# Altium schematic sheet UBX_NORA_B1_SCHEM_0003_Shield_Conn.SchDoc
size A3; Date: 7/24/2020; CompanyName: U-blox; DrawnBy: EMOO; Engineer: EMOO; Organization: U-blox; Address1: 3950 Fairview Industrial Dr SE #100; Address2: Salem, OR 97302; SheetNumber: 3; SheetTotal: 6; SheetSize: B; SheetTitle: Connectors
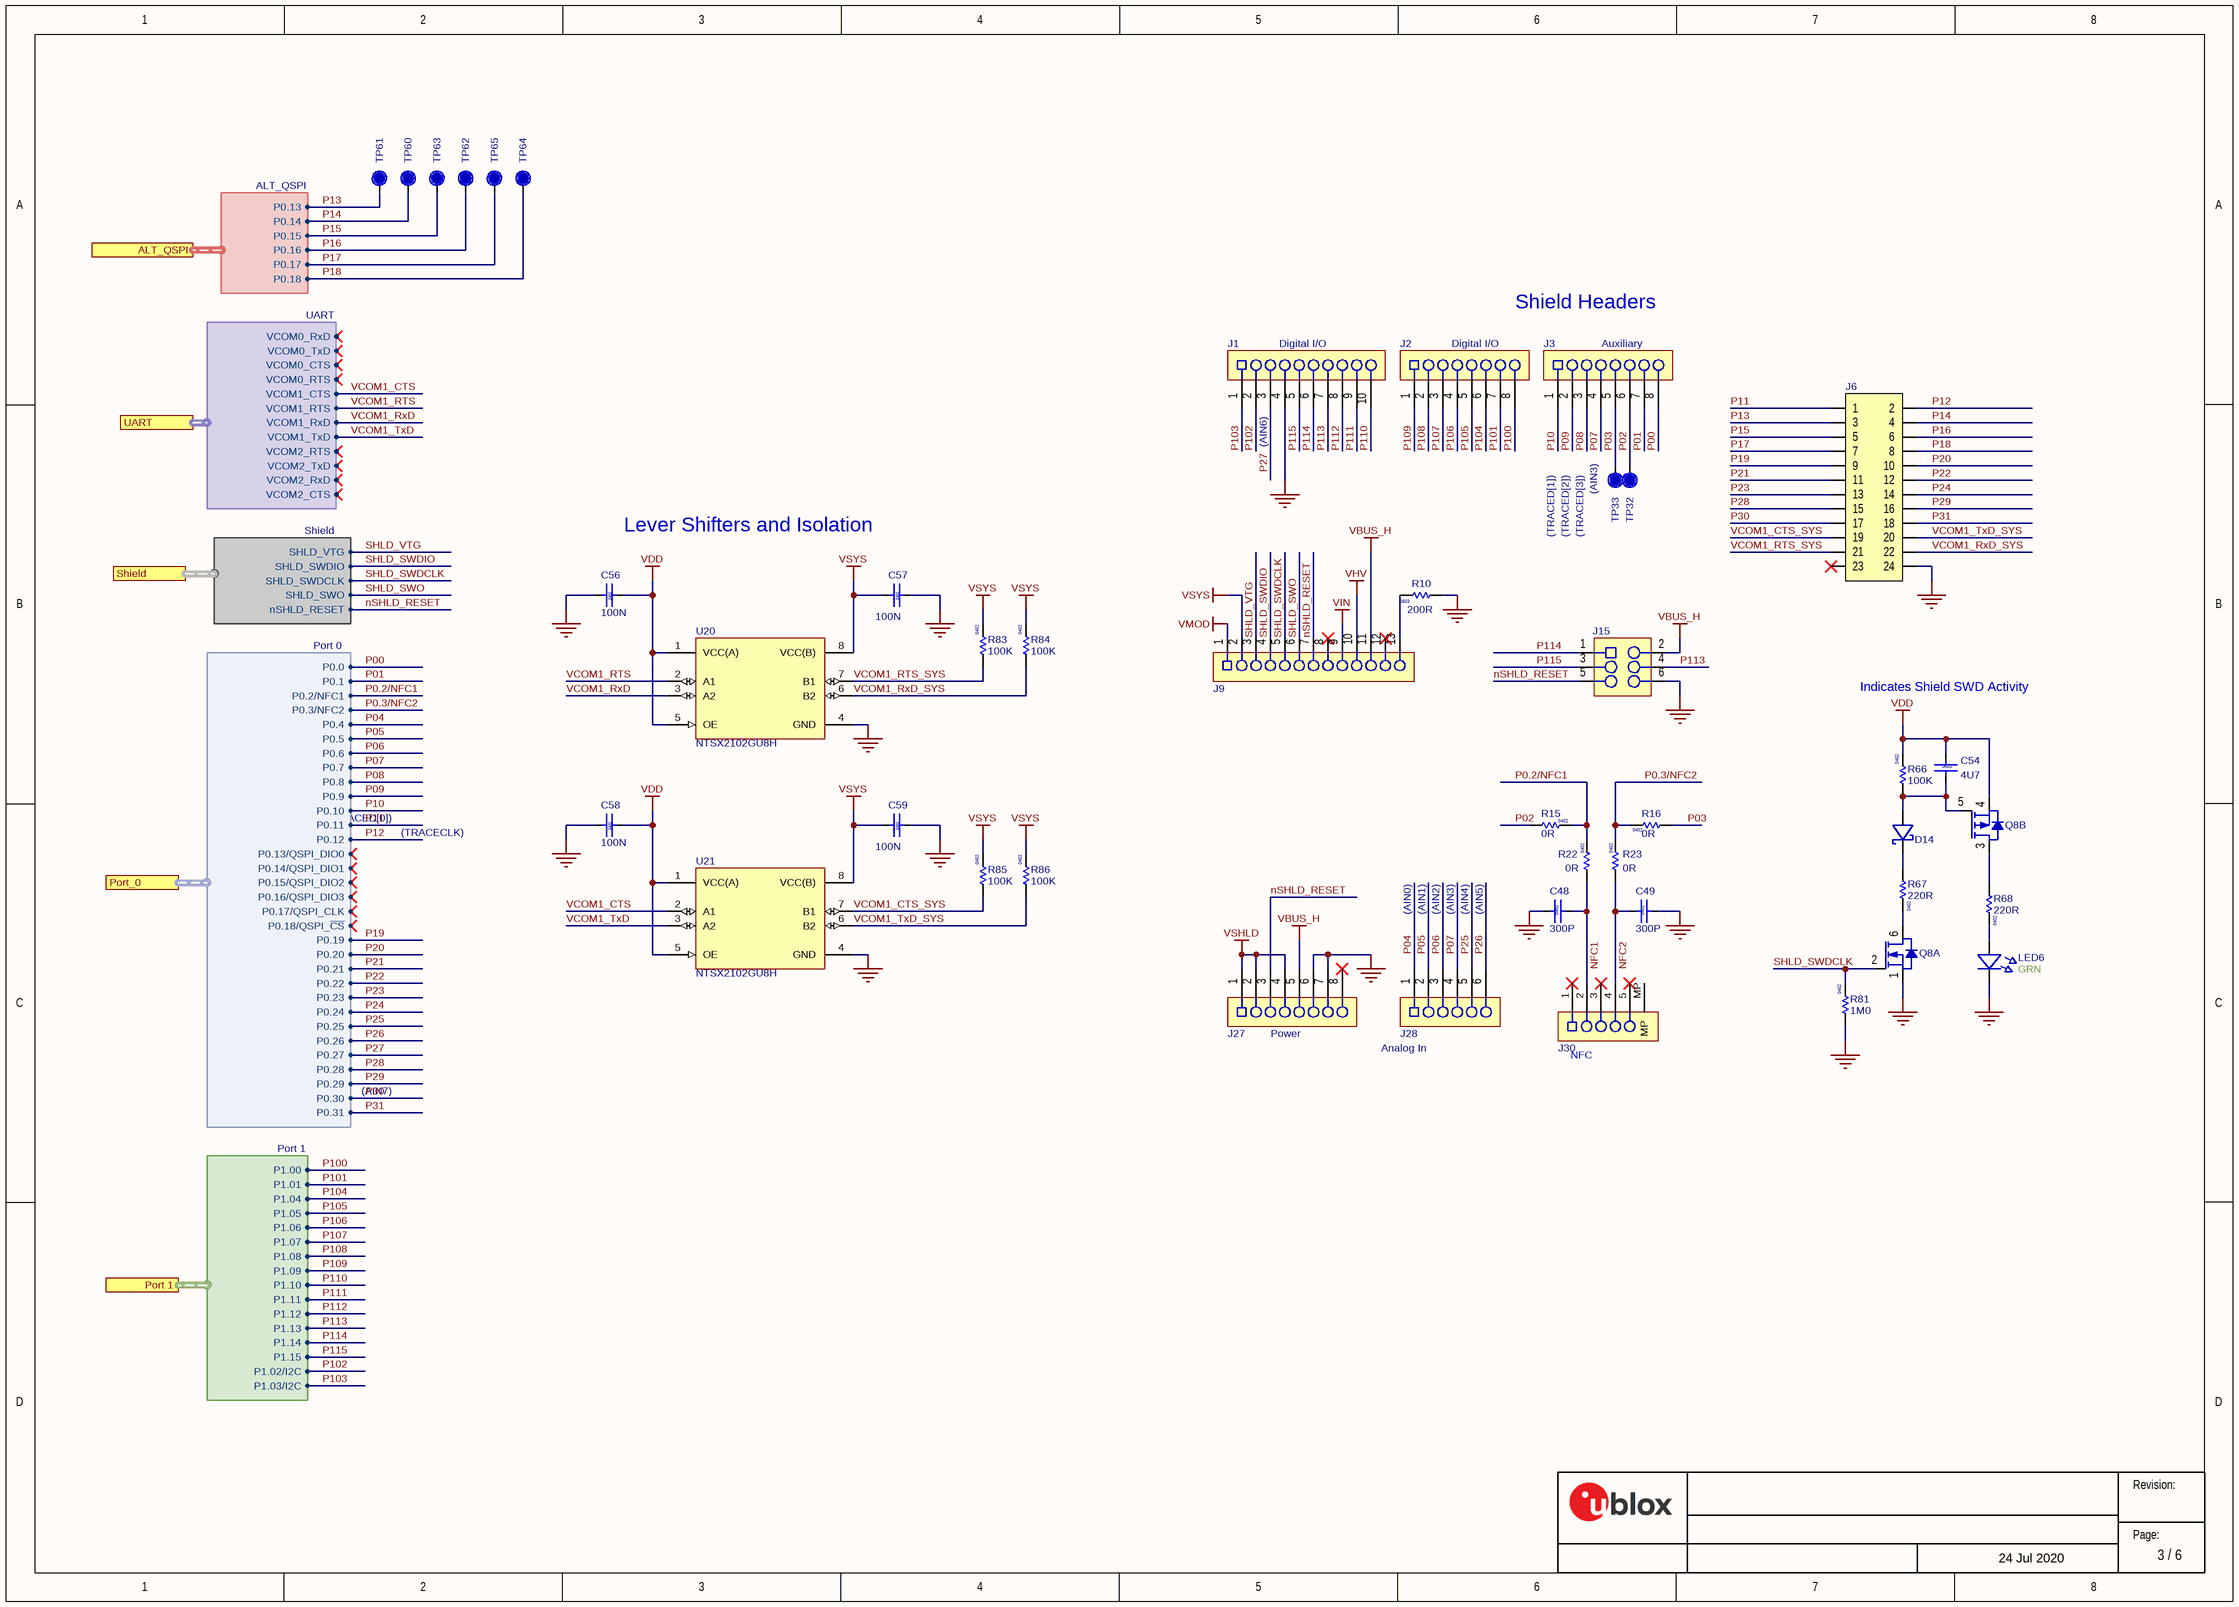
[diagram p0: UBX_NORA_B1_SCHEM_0003_Shield_Conn.SchDoc]

## Parts
C48  value 300P  Size: 0402  [Cap 0402 HD]
C49  value 300P  Size: 0402  [Cap 0402 HD]
C54  value 4U7  Size: 0603  [CAP 0603 HD]
C56  value 100N  Size: 0402  [Cap 0402 HD]
C57  value 100N  Size: 0402  [Cap 0402 HD]
C58  value 100N  Size: 0402  [Cap 0402 HD]
C59  value 100N  Size: 0402  [Cap 0402 HD]
D14  (no value)  [SOD-523]
J1  (no value)  [SKT-0.1P-SSM-110-L-SV]
J2  (no value)  [SKT-0.1P-SSM-108-L-SV]
J3  (no value)  [SKT-0.1P-SSM-108-L-SV]
J6  SSM-112-F-DV  [SSM-112-F-DV]  (value not drawn)
J9  (no value)  [TSM-113-01-L-SV]
J15  (no value)  [HDR-0.1P-6Pin-3x2-SMT]
J27  (no value)  [SKT-0.1P-SSM-108-L-SV]
J28  (no value)  [SKT-0.1P-SSM-106-L-SV]
J30  UBXH04-0000800  [Molex 051281-0594]  (value not drawn)
LED6  Color: GRN  [LED_0603_GREEN]
Q8  (no value)  [SOT-563]  (parts A,B of 2)
R10  value 200R  Size: 0603  [RES 0603 HD]
R15  value 0R  Size: 0402  [RES 0402 HD]
R16  value 0R  Size: 0402  [RES 0402 HD]
R22  value 0R  Size: 0402  [RES 0402 HD]
R23  value 0R  Size: 0402  [RES 0402 HD]
R66  value 100K  Size: 0402  [RES 0402 HD]
R67  value 220R  Size: 0402  [RES 0402 HD]
R68  value 220R  Size: 0402  [RES 0402 HD]
R81  value 1M0  Size: 0402  [RES 0402 HD]
R83  value 100K  Size: 0402  [RES 0402 HD]
R84  value 100K  Size: 0402  [RES 0402 HD]
R85  value 100K  Size: 0402  [RES 0402 HD]
R86  value 100K  Size: 0402  [RES 0402 HD]
TP32  TP  [TP10R]  (value not drawn)  (no BOM)
TP33  TP  [TP10R]  (value not drawn)  (no BOM)
TP60  TP  [TP10R]  (value not drawn)  (no BOM)
TP61  TP  [TP10R]  (value not drawn)  (no BOM)
TP62  TP  [TP10R]  (value not drawn)  (no BOM)
TP63  TP  [TP10R]  (value not drawn)  (no BOM)
TP64  TP  [TP10R]  (value not drawn)  (no BOM)
TP65  TP  [TP10R]  (value not drawn)  (no BOM)
U20  Manufacturer Part Number 1: NTSX2102GU8H  [QFN0.4P3x1-8Pin]
U21  Manufacturer Part Number 1: NTSX2102GU8H  [QFN0.4P3x1-8Pin]

## Ports
ALT_QSPI (harness ALT_QSPI), Port 1 (harness Port 1), Port_0 (harness Port 0), Shield (harness Shield), UART (harness UART)

## Harnesses
Port 1: P1.00, P1.01, P1.02/I2C, P1.03/I2C, P1.04, P1.05, P1.06, P1.07, P1.08, P1.09, P1.10, P1.11, P1.12, P1.13, P1.14, P1.15
Port 0: P0.4, P0.5, P0.6, P0.7, P0.8, P0.9, P0.10, P0.11, P0.12, P0.19, P0.20, P0.21, P0.22, P0.23, P0.24, P0.25, P0.26, P0.27, P0.28, P0.29, P0.30, P0.31, P0.3/NFC2, P0.2/NFC1, P0.13/QSPI_DIO0, P0.14/QSPI_DIO1, P0.15/QSPI_DIO2, P0.16/QSPI_DIO3, P0.18/QSPI_~{CS}, P0.17/QSPI_CLK, P0.0, P0.1
ALT_QSPI: P0.13, P0.14, P0.15, P0.16, P0.17, P0.18
Shield: SHLD_VTG, SHLD_SWDIO, SHLD_SWDCLK, SHLD_SWO, nSHLD_RESET
UART: VCOM2_TxD, VCOM2_RxD, VCOM2_RTS, VCOM2_CTS, VCOM1_RxD, VCOM1_TxD, VCOM1_CTS, VCOM1_RTS, VCOM0_RxD, VCOM0_TxD, VCOM0_CTS, VCOM0_RTS

## Nets
GND: C48.1 C49.2 C56.2 C57.1 C58.2 C59.1 J1.4 J6.24 J15.6 J27.6 J27.7 LED6.1(C) Q8.1(S1) R10.1 R81.1 U20.4(GND) U21.4(GND)
VBUS_H: J9.11 J15.2 J27.5
VDD: C54.1 C56.1 C58.1 Q8.4(S2) R66.2 U20.1(VCC(A)) U20.5(OE) U21.1(VCC(A)) U21.5(OE)
VHV: J9.10
VIN: J9.9
VMOD: J9.1
VSHLD: J27.1 J27.2 J27.4
VSYS: C57.2 C59.2 J9.2 R83.2 R84.2 R85.2 R86.2 U20.8(VCC(B)) U21.8(VCC(B))
NFC1: C48.2 J30.2 R22.1
NFC2: C49.1 J30.4 R23.1
nSHLD_RESET: J9.7 J15.5 J27.3 ; port Shield.nSHLD_RESET
P00: J3.8 ; port Port_0.P0.0
P0.2/NFC1: R15.2 R22.2 ; port Port_0.P0.2/NFC1
P0.3/NFC2: R16.2 R23.2 ; port Port_0.P0.3/NFC2
P01: J3.7 ; port Port_0.P0.1
P02: J3.6 R15.1 TP32.1
P03: J3.5 R16.1 TP33.1
P04: J28.1 ; port Port_0.P0.4
P05: J28.2 ; port Port_0.P0.5
P06: J28.3 ; port Port_0.P0.6
P07: J3.4 J28.4 ; port Port_0.P0.7
P08: J3.3 ; port Port_0.P0.8
P09: J3.2 ; port Port_0.P0.9
P10: J3.1 ; port Port_0.P0.10
P11: J6.1 ; port Port_0.P0.11
P12: J6.2 ; port Port_0.P0.12
P13: J6.3 TP61.1 ; port ALT_QSPI.P0.13
P14: J6.4 TP60.1 ; port ALT_QSPI.P0.14
P15: J6.5 TP63.1 ; port ALT_QSPI.P0.15
P16: J6.6 TP62.1 ; port ALT_QSPI.P0.16
P17: J6.7 TP65.1 ; port ALT_QSPI.P0.17
P18: J6.8 TP64.1 ; port ALT_QSPI.P0.18
P19: J6.9 ; port Port_0.P0.19
P20: J6.10 ; port Port_0.P0.20
P21: J6.11 ; port Port_0.P0.21
P22: J6.12 ; port Port_0.P0.22
P23: J6.13 ; port Port_0.P0.23
P24: J6.14 ; port Port_0.P0.24
P25: J28.5 ; port Port_0.P0.25
P26: J28.6 ; port Port_0.P0.26
P27: J1.3 ; port Port_0.P0.27
P28: J6.15 ; port Port_0.P0.28
P29: J6.16 ; port Port_0.P0.29
P30: J6.17 ; port Port_0.P0.30
P31: J6.18 ; port Port_0.P0.31
P100: J2.8 ; port Port 1.P1.00
P101: J2.7 ; port Port 1.P1.01
P102: J1.2 ; port Port 1.P1.02/I2C
P103: J1.1 ; port Port 1.P1.03/I2C
P104: J2.6 ; port Port 1.P1.04
P105: J2.5 ; port Port 1.P1.05
P106: J2.4 ; port Port 1.P1.06
P107: J2.3 ; port Port 1.P1.07
P108: J2.2 ; port Port 1.P1.08
P109: J2.1 ; port Port 1.P1.09
P110: J1.10 ; port Port 1.P1.10
P111: J1.9 ; port Port 1.P1.11
P112: J1.8 ; port Port 1.P1.12
P113: J1.7 J15.4 ; port Port 1.P1.13
P114: J1.6 J15.1 ; port Port 1.P1.14
P115: J1.5 J15.3 ; port Port 1.P1.15
SHLD_SWDCLK: J9.5 Q8.2(G1) R81.2 ; port Shield.SHLD_SWDCLK
SHLD_SWDIO: J9.4 ; port Shield.SHLD_SWDIO
SHLD_SWO: J9.6 ; port Shield.SHLD_SWO
SHLD_VTG: J9.3 ; port Shield.SHLD_VTG
VCOM1_CTS: U21.2(A1) ; port UART.VCOM1_CTS
VCOM1_CTS_SYS: J6.19 R85.1 U21.7(B1)
VCOM1_RTS: U20.2(A1) ; port UART.VCOM1_RTS
VCOM1_RTS_SYS: J6.21 R83.1 U20.7(B1)
VCOM1_RxD: U20.3(A2) ; port UART.VCOM1_RxD
VCOM1_RxD_SYS: J6.22 R84.1 U20.6(B2)
VCOM1_TxD: U21.3(A2) ; port UART.VCOM1_TxD
VCOM1_TxD_SYS: J6.20 R86.1 U21.6(B2)
NetC54_2: C54.2 D14.A(Anode) Q8.5(G2) R66.1
NetD14_C: D14.C(Cathode) R67.1
NetJ9_13: J9.13 R10.2
NetLED6_2: LED6.2(A) R68.2
NetQ8_3: Q8.3(D2) R68.1
NetQ8_6: Q8.6(D1) R67.2

Not connected (* = marked no-connect by the designer): J6 23*; J9 8* 12*; J27 8*; J30 1* 3* 5* MP

## Notes on the sheet
- (near J1) Digital I/O
- (near J2) Digital I/O
- Shield Headers
- (near J3) Auxiliary
- (near J1) (AIN6)
- Lever Shifters and Isolation
- (TRACED[1])
- (TRACED[2])
- (TRACED[3])
- (near TP33) (AIN3)
- Indicates Shield SWD Activity
- (TRACED[0])
- (TRACECLK)
- (AIN0)
- (AIN1)
- (AIN2)
- (AIN3)
- (AIN4)
- (AIN5)
- (near J27) Power
- (near J28) Analog In
- (near J30) NFC
- (AIN7)
- 24 Jul 2020
- Revision:
- Page:

## Library data of the parts
C48 C49 = UBXH01-0000594: CAP CER C0G 0402 300P 50V; Manufacturer: Murata Manufacturing Company, Ltd.; Manufacturer P/N: GRM1555C1H301JA01D; Editor: eric.moog; Env: ROHS; Permitted Use: Volume Products; Perferred: PREF; Mfg P/N Status: Active; Mfg P/N Split: 100; Mfg P/N Released: No; Part Number: UBXH01-0000594; Max Voltage: 50V; Min Operating Temp: -55°C; Max Operating Temp: 125°C; Part Type: Capacitor; UBX Wiki: https://wiki.u-blox.com/bin/view/Operations/PartDetails?index=38856; RefDes: C
C54 = UBXH01-2002003: CAP CER X5R 0603 4U7 10% 6.3V; Manufacturer: Murata Manufacturing Company, Ltd.; Manufacturer P/N: GRM188R61C475KE11; Editor: philippe.largier; Released by: roland.rust; Env: GREEN; Permitted Use: Volume Products; Perferred: PREF; Mfg P/N Status: Active; Mfg P/N Split: 100; Mfg P/N Released: Yes; Part Number: UBXH01-2002003; Tolerance: 10%; Max Voltage: 6.3V; Part Type: Capacitor; Release Data: 2016-02-02T16:39:45; UBX Wiki: https://wiki.u-blox.com/bin/view/Operations/PartDetails?index=5742; RefDes: C; Mfg P/N Datasheet: https://wiki.u-blox.com/bin/view/Generic/Docs/DocumentSummary?index=30154; Manufacturer 2: Murata Manufacturing Company, Ltd.; Manufacturer P/N 2: GRM188R61E475KE11; Mfg P/N Status 2: Active; Mfg P/N Split 2: 0; Mfg P/N Released 2: Yes; Mfg P/N Datasheet 2: https://wiki.u-blox.com/bin/view/Generic/Docs/DocumentSummary?index=30500; Manufacturer 3: Samsung Electro-Mechanics; Manufacturer P/N 3: CL10A475KO8NNN; Mfg P/N Status 3: NRND; Mfg P/N Split 3: 0; Mfg P/N Released 3: Yes; Mfg P/N Datasheet 3: https://wiki.u-blox.com/bin/view/Generic/Docs/DocumentSummary?index=28177
C56-C59 = UBXH01-2021002: CAP CER X5R 0402 100N 10% 10V; Manufacturer: Murata Manufacturing Company, Ltd.; Manufacturer P/N: GRM155R61A104KA01; Editor: roland.rust; Env: GREEN; Permitted Use: Volume Products; Perferred: PREF; Mfg P/N Status: NRND; Mfg P/N Split: 100; Mfg P/N Released: Yes; Part Number: UBXH01-2021002; Tolerance: 10%; Max Voltage: 10V; Part Type: Capacitor; Released by: roland.rust; Release Data: 2005-07-22T13:59:44; UBX Wiki: https://wiki.u-blox.com/bin/view/Operations/PartDetails?index=5759; RefDes: C; Manufacturer 2: Samsung Electro-Mechanics; Manufacturer P/N 2: CL05A104KP5NNN; Mfg P/N Status 2: Active; Mfg P/N Split 2: 0; Mfg P/N Released 2: Yes; Mfg P/N Datasheet 2: https://wiki.u-blox.com/bin/view/Generic/Docs/DocumentSummary?index=28113
D14 = UBXH07-0000039: SCHOTTKY BARRIER DIODE 30V 200mA; Manufacturer: ON Semiconductor; Value: RB521S30T1G; Editor: matej.budin; Released by: pierpaolo.arban; Env: ROHS; Permitted Use: Volume Products; Perferred: PREF; Mfg P/N Status: Active; Mfg P/N Split: 100; Mfg P/N Released: Yes; Part Number: UBXH07-0000039; Max Voltage: 30V; Max Current: 200mA; Part Type: Diode; Release Data: 2015-06-18T10:04:48; UBX Wiki: https://wiki.u-blox.com/bin/view/Operations/PartDetails?index=22753; RefDes: D; Manufacturer P/N: RB521S30T1G; Mfg P/N Datasheet: https://wiki.u-blox.com/bin/view/Generic/Docs/DocumentSummary?index=22755
J1 = UBXH04-0000788: 10 -PIN RECEPTACLE BOTTOM OR TOP ENTRY VERT 2.54MM 50V 2.5A; Manufacturer P/N: 91601-310GLF; Manufacturer: Amphenol Corporation; Value: 91601-310GLF; Editor: eric.moog; Env: ROHS; Permitted Use: Support Products; Mfg P/N Status: Active; Mfg P/N Split: 100; Mfg P/N Released: No; Part Number: UBXH04-0000788; Max Voltage: 50V; Max Current: 2.5A; Min Operating Temp: -65°C; Max Operating Temp: 150°C; Part Type: Connector; UBX Wiki: https://wiki.u-blox.com/bin/view/Operations/PartDetails?index=38561; Perferred: N/A; RefDes: J; Mfg P/N Datasheet: https://wiki.u-blox.com/bin/view/Generic/Docs/DocumentSummary?index=38560
J2 J3 J27 = UBXH04-0000789: 8 -PIN RECEPTACLE BOTTOM OR TOP ENTRY VERT 2.54MM 50V 2.5A; Manufacturer: Amphenol Corporation; Value: 91601-308GLF; Editor: eric.moog; Env: ROHS; Permitted Use: Support Products; Mfg P/N Status: Active; Mfg P/N Split: 100; Mfg P/N Released: No; Part Number: UBXH04-0000789; Max Voltage: 50V; Max Current: 2.5A; Min Operating Temp: -65°C; Max Operating Temp: 150°C; Part Type: Connector; UBX Wiki: https://wiki.u-blox.com/bin/view/Operations/PartDetails?index=38563; Perferred: N/A; RefDes: J; Manufacturer P/N: 91601-308GLF; Mfg P/N Datasheet: https://wiki.u-blox.com/bin/view/Generic/Docs/DocumentSummary?index=38560
J6 = UBXH04-0000802: 2-ROW SMD PCB CONN SOCKET 100MIL GRID 24-PIN 0.64MM SQUARE 405V 5.2A; Manufacturer 1: Samtec; Artikkelnr Noca: N.A.; Editor: eric.moog; Env: ROHS; Permitted Use: Support Products; Perferred: PREF; Mfg P/N Status: Active; Mfg P/N Split: 100; Mfg P/N Released: No; Part Number: UBXH04-0000802; Manufacturer Part Number 1: SSM-112-F-DV; ComponentLink1URL: *; ComponentLink1Description: Datasheet; ComponentLink2URL: *; ComponentLink2Description: Supplier link; HelpURL: *; Footprint Doc: SOCKET_2x12_SMD-2.54mm; LatestRevisionDate: 2019-08-05; Pin Count: 24; Value: SSM-112-F-DV; Note: *; Supplier 1: Cabcon; Supplier Part Number 1: 2171-212MS0CUNR1; Supplier 2: Samtec; Supplier Part Number 2: SSM-112-F-DV; Part number IPS: N.A.; Manufacturer: Samtec; Manufacturer P/N: SSM-112-F-DV; Max Voltage: 405V; Max Current: 5.2A; Min Operating Temp: -55°C; Max Operating Temp: 125°C; Part Type: Connector; UBX Wiki: https://wiki.u-blox.com/bin/view/Operations/PartDetails?index=38898; RefDes: J; Mfg P/N Datasheet: https://wiki.u-blox.com/bin/view/Generic/Docs/DocumentSummary?index=21260
J9 = UBXH04-0000801: 1-ROW SMD-PCB CONN 13 -PIN 2.54MM STRIP 475V 4.1A; Manufacturer: Samtec; Value: TSM-113-01-L-SV; Editor: eric.moog; Env: ROHS; Permitted Use: Support Products; Perferred: PREF; Mfg P/N Status: Active; Mfg P/N Split: 100; Mfg P/N Released: No; Part Number: UBXH04-0000801; Max Voltage: 475V; Max Current: 4.1A; Min Operating Temp: -55°C; Max Operating Temp: 125°C; Part Type: Connector; UBX Wiki: https://wiki.u-blox.com/bin/view/Operations/PartDetails?index=38895; RefDes: J; Manufacturer P/N: TSM-113-01-L-SV; Mfg P/N Datasheet: https://wiki.u-blox.com/bin/view/Generic/Docs/DocumentSummary?index=15851
J15 = UBXH04-0000805: 2-ROW CONN SMD VERT 2X06 PIN 2.54MM 100V 2A; Manufacturer P/N: 0015912060; Manufacturer: molex; Value: 0015912060; Editor: eric.moog; Env: ROHS; Permitted Use: Support Products; Perferred: PREF; Mfg P/N Status: Active; Mfg P/N Split: 100; Mfg P/N Released: No; Part Number: UBXH04-0000805; Max Voltage: 100V; Max Current: 2A; Min Operating Temp: -40°C; Max Operating Temp: 85°C; Part Type: Connector; UBX Wiki: https://wiki.u-blox.com/bin/view/Operations/PartDetails?index=38947; RefDes: J; Mfg P/N Datasheet: https://wiki.u-blox.com/bin/view/Generic/Docs/DocumentSummary?index=38946
J28 = UBXH04-0000790: 6 -PIN RECEPTACLE BOTTOM OR TOP ENTRY VERT 2.54MM 50V 2.5A; Manufacturer P/N: 91601-306GLF; Manufacturer: Amphenol Corporation; Value: 91601-306GLF; Editor: eric.moog; Env: ROHS; Permitted Use: Support Products; Mfg P/N Status: Active; Mfg P/N Split: 100; Mfg P/N Released: No; Part Number: UBXH04-0000790; Max Voltage: 50V; Max Current: 2.5A; Min Operating Temp: -65°C; Max Operating Temp: 150°C; Part Type: Connector; UBX Wiki: https://wiki.u-blox.com/bin/view/Operations/PartDetails?index=38565; Perferred: N/A; RefDes: J; Mfg P/N Datasheet: https://wiki.u-blox.com/bin/view/Generic/Docs/DocumentSummary?index=38560
J30 = UBXH04-0000800: CONN NON ZIF FPC MOLEX 51281 0.5MM PITCH 5-PIN TOP AND BOTTOM 50V 500mA; Manufacturer P/N: 0512810598; Part Name: CON FFC/FPC 0.50mm 5Pos R/A; Part_Type: Connector; Manufacturer 1: KYOCERA AVX; Manufacturer Part Number 1: 046284005001846; Item_Phase: Preliminary; Component Mounting Type: SMT; Keyed: No; Rows: 1; Use in new designs: Yes; Value: 0512810598; Editor: eric.moog; Env: ROHS; Permitted Use: Support Products; Perferred: PREF; Mfg P/N Status: Active; Mfg P/N Split: 100; Part Number: UBXH04-0000800; Color: White; Connector Type: FPC; Height: 1.3mm; Length: 4.05mm; Locking: No; Pin Pitch: 0.5mm; Pins: 5; Voltage: 50V; Width: 4.4mm; Max Voltage: 50V; Max Current: 500mA; Min Operating Temp: -30°C; Max Operating Temp: 85°C; Part Type: Connector; UBX Wiki: https://wiki.u-blox.com/bin/view/Operations/PartDetails?index=38893; RefDes: J; Manufacturer: molex; Mfg P/N Released: No; Mfg P/N Datasheet: https://wiki.u-blox.com/bin/view/Generic/Docs/DocumentSummary?index=38892
LED6 = UBXH11-0000001: LED SMD 0603 GREEN 2.5V 20mA; Manufacturer: Kingbright; Manufacturer P/N: APT1608SGC; Editor: gianni.falleroni; Released by: alex.claville; Env: ROHS; Permitted Use: Support Products; Mfg P/N Status: Active; Mfg P/N Split: 50; Mfg P/N Released: Yes; Part Number: UBXH11-0000001; Value: GREEN; Max Voltage: 2.5V; Max Current: 20mA; Size: 0603; Part Type: LED; Release Data: 2022-09-27T14:26:54; UBX Wiki: https://wiki.u-blox.com/bin/view/Operations/PartDetails?index=7902; Perferred: N/A; RefDes: DS; Mfg P/N Datasheet: https://wiki.u-blox.com/bin/view/Generic/Docs/DocumentSummary?index=37527; Manufacturer 2: Lite-on Technology Corporation; Manufacturer P/N 2: LTST-C190KGKT; Mfg P/N Status 2: Active; Mfg P/N Split 2: 50; Mfg P/N Released 2: Yes; Mfg P/N Datasheet 2: https://wiki.u-blox.com/bin/view/Generic/Docs/DocumentSummary?index=16220
Q8 = UBXH20-0000084: SMALL SIGNAL COMPLEMENTARY W/ ESD PROTECTION MOSFET SOT-563-6 PACKAGE; Manufacturer: ON Semiconductor; Value: NTZD3155CT1G; Editor: pierpaolo.arban; Released by: matej.budin; Env: ROHS; Permitted Use: Support Products; Perferred: PREF; Mfg P/N Status: Active; Mfg P/N Split: 100; Mfg P/N Released: Yes; Part Number: UBXH20-0000084; Min Operating Temp: -55°C; Max Operating Temp: 155°C; Part Type: Transistor; Release Data: 2023-01-26T11:59:16; UBX Wiki: https://wiki.u-blox.com/bin/view/Operations/PartDetails?index=37717; RefDes: Q; Manufacturer P/N: NTZD3155CT1G; Mfg P/N Datasheet: https://wiki.u-blox.com/bin/view/Generic/Docs/DocumentSummary?index=9037
R10 = UBXH18-0007056: RES THICK FILM CHIP 0603 200R 5% 100mW; Editor: andreas.thiel; Env: ROHS; Permitted Use: Volume Products; Perferred: NONPREF; Part Number: UBXH18-0007056; Tolerance: 5%; Max Power: 100mW; Part Type: Resistor; UBX Wiki: https://wiki.u-blox.com/bin/view/Operations/PartDetails?index=6682; RefDes: R
R15 R16 R22 R23 = UBXH18-0003002: RES THICK FILM CHIP 0402 0R 0 100mW; Manufacturer: KOA; Manufacturer P/N: RK73Z1ETTD; Tolerance: 0; Editor: charlotte.biber; Released by: peter.mueller; Env: ROHS; Permitted Use: Volume Products; Perferred: PREF; Mfg P/N Status: NRND; Mfg P/N Split: 100; Mfg P/N Released: Yes; Part Number: UBXH18-0003002; Max Power: 100mW; Part Type: Resistor; Release Data: 2012-06-05T09:49:55; UBX Wiki: https://wiki.u-blox.com/bin/view/Operations/PartDetails?index=6611; RefDes: R; Manufacturer 2: YAGEO; Manufacturer P/N 2: 2322_705_91001_L; Mfg P/N Status 2: NRND; Mfg P/N Split 2: 0; Mfg P/N Released 2: Yes
R66 R83-R86 = UBXH18-0000005: RES THICK FILM CHIP 0402 100K 1% 63mW; Manufacturer: KOA; Manufacturer P/N: RK73H1ETTP1003F; Editor: dario.antonaz; Released by: sandro.sestan; Env: ROHS; Permitted Use: Volume Products; Mfg P/N Status: Active; Mfg P/N Split: 100; Mfg P/N Released: Yes; Part Number: UBXH18-0000005; Tolerance: 1%; Max Power: 63mW; Part Type: Resistor; Release Data: 2009-11-30T11:05:22; UBX Wiki: https://wiki.u-blox.com/bin/view/Operations/PartDetails?index=8114; Perferred: N/A; RefDes: R; Mfg P/N Datasheet: https://wiki.u-blox.com/bin/view/Generic/Docs/DocumentSummary?index=8222; Manufacturer 2: ROHM; Manufacturer P/N 2: MCR01MZPF1003; Mfg P/N Status 2: Active; Mfg P/N Split 2: 0; Mfg P/N Released 2: Yes; Mfg P/N Datasheet 2: https://wiki.u-blox.com/bin/view/Generic/Docs/DocumentSummary?index=8186
R67 R68 = UBXH18-0008033: RES THICK FILM CHIP 0402 220R 5% 100mW; Manufacturer: ROHM; Manufacturer P/N: MCR01MZPJ221; Editor: roland.rust; Env: ROHS; Permitted Use: Volume Products; Perferred: PREF; Mfg P/N Status: Active; Mfg P/N Split: 100; Mfg P/N Released: Yes; Part Number: UBXH18-0008033; Tolerance: 5%; Max Power: 100mW; Part Type: Resistor; Released by: roland.rust; Release Data: 2009-04-24T14:36:39; UBX Wiki: https://wiki.u-blox.com/bin/view/Operations/PartDetails?index=6914; RefDes: R; Manufacturer 2: KOA; Manufacturer P/N 2: RK73B1ETTP221J; Mfg P/N Status 2: Active; Mfg P/N Split 2: 0; Mfg P/N Released 2: Yes; Manufacturer 3: YAGEO; Manufacturer P/N 3: 2322_705_87221_L; Mfg P/N Status 3: NRND; Mfg P/N Split 3: 0; Mfg P/N Released 3: Yes
R81 = UBXH18-0008121: RES THICK FILM CHIP 0402 1M0 5% 63mW; Manufacturer: KOA; Manufacturer P/N: RK73B1ETTP105J; Editor: daniel.hurni; Released by: doris.zahnd; Env: ROHS; Permitted Use: Volume Products; Perferred: PREF; Mfg P/N Status: Active; Mfg P/N Split: 100; Mfg P/N Released: Yes; Part Number: UBXH18-0008121; Tolerance: 5%; Max Power: 63mW; Min Operating Temp: -55°C; Max Operating Temp: 125°C; Part Type: Resistor; Release Data: 2009-12-01T17:35:03; UBX Wiki: https://wiki.u-blox.com/bin/view/Operations/PartDetails?index=7052; RefDes: R; Mfg P/N Datasheet: https://wiki.u-blox.com/bin/view/Generic/Docs/DocumentSummary?index=4543
TP32 TP33 TP60-TP65 = UBXH00-0000096: TESTPOINT 1MM CIRCULAR; Editor: eric.moog; Permitted Use: Volume Products; Perferred: PREF; Part Number: UBXH00-0000096; Min Operating Temp: -55°C; Max Operating Temp: 125°C; Part Type: Testpoint; UBX Wiki: https://wiki.u-blox.com/bin/view/Operations/PartDetails?index=38784; Env: N/A; RefDes: TP
U20 U21 = UBXH10-0000106: 2-BIT BIDIRECTIONAL TRANSLATING TRANSCEIVER AUTO DIRECTION SENSING OPEN DRAIN XQFN8 5.5V; Part Name: IC TXRX TRANSLATING 8XQFN; Part_Type: Digital Logic; Manufacturer 1: NXP Semiconductors; Manufacturer: NXP; Body Size: 1.4mm X 1.2mm; Component Mounting Type: SMT; Logic Type: Level Translator; MFG Package: XFQFN-8; Number of Circuits: 1; SMT Pitch: 0.4mm; Use in new designs: Yes; Value: NTSX2102GU8; Editor: eric.moog; Env: ROHS; Permitted Use: Volume Products; Perferred: PREF; Mfg P/N Status: Active; Mfg P/N Split: 100; Mfg P/N Released: No; Part Number: UBXH10-0000106; Height: 0.5mm; Package Type: QFN; Pins: 8; Voltage: 5.5V; Max Voltage: 5.5V; Min Operating Temp: -40°C; Max Operating Temp: 85°C; Part Type: Interface; UBX Wiki: https://wiki.u-blox.com/bin/view/Operations/PartDetails?index=38826; RefDes: U; Manufacturer P/N: NTSX2102GU8; Mfg P/N Datasheet: https://wiki.u-blox.com/bin/view/Generic/Docs/DocumentSummary?index=38756